# Altium schematic sheet sensor_module.SchDoc: Sensor Module
size A3; DocumentNumber: 1; Revision: F; SheetNumber: 1; SheetTotal: 1
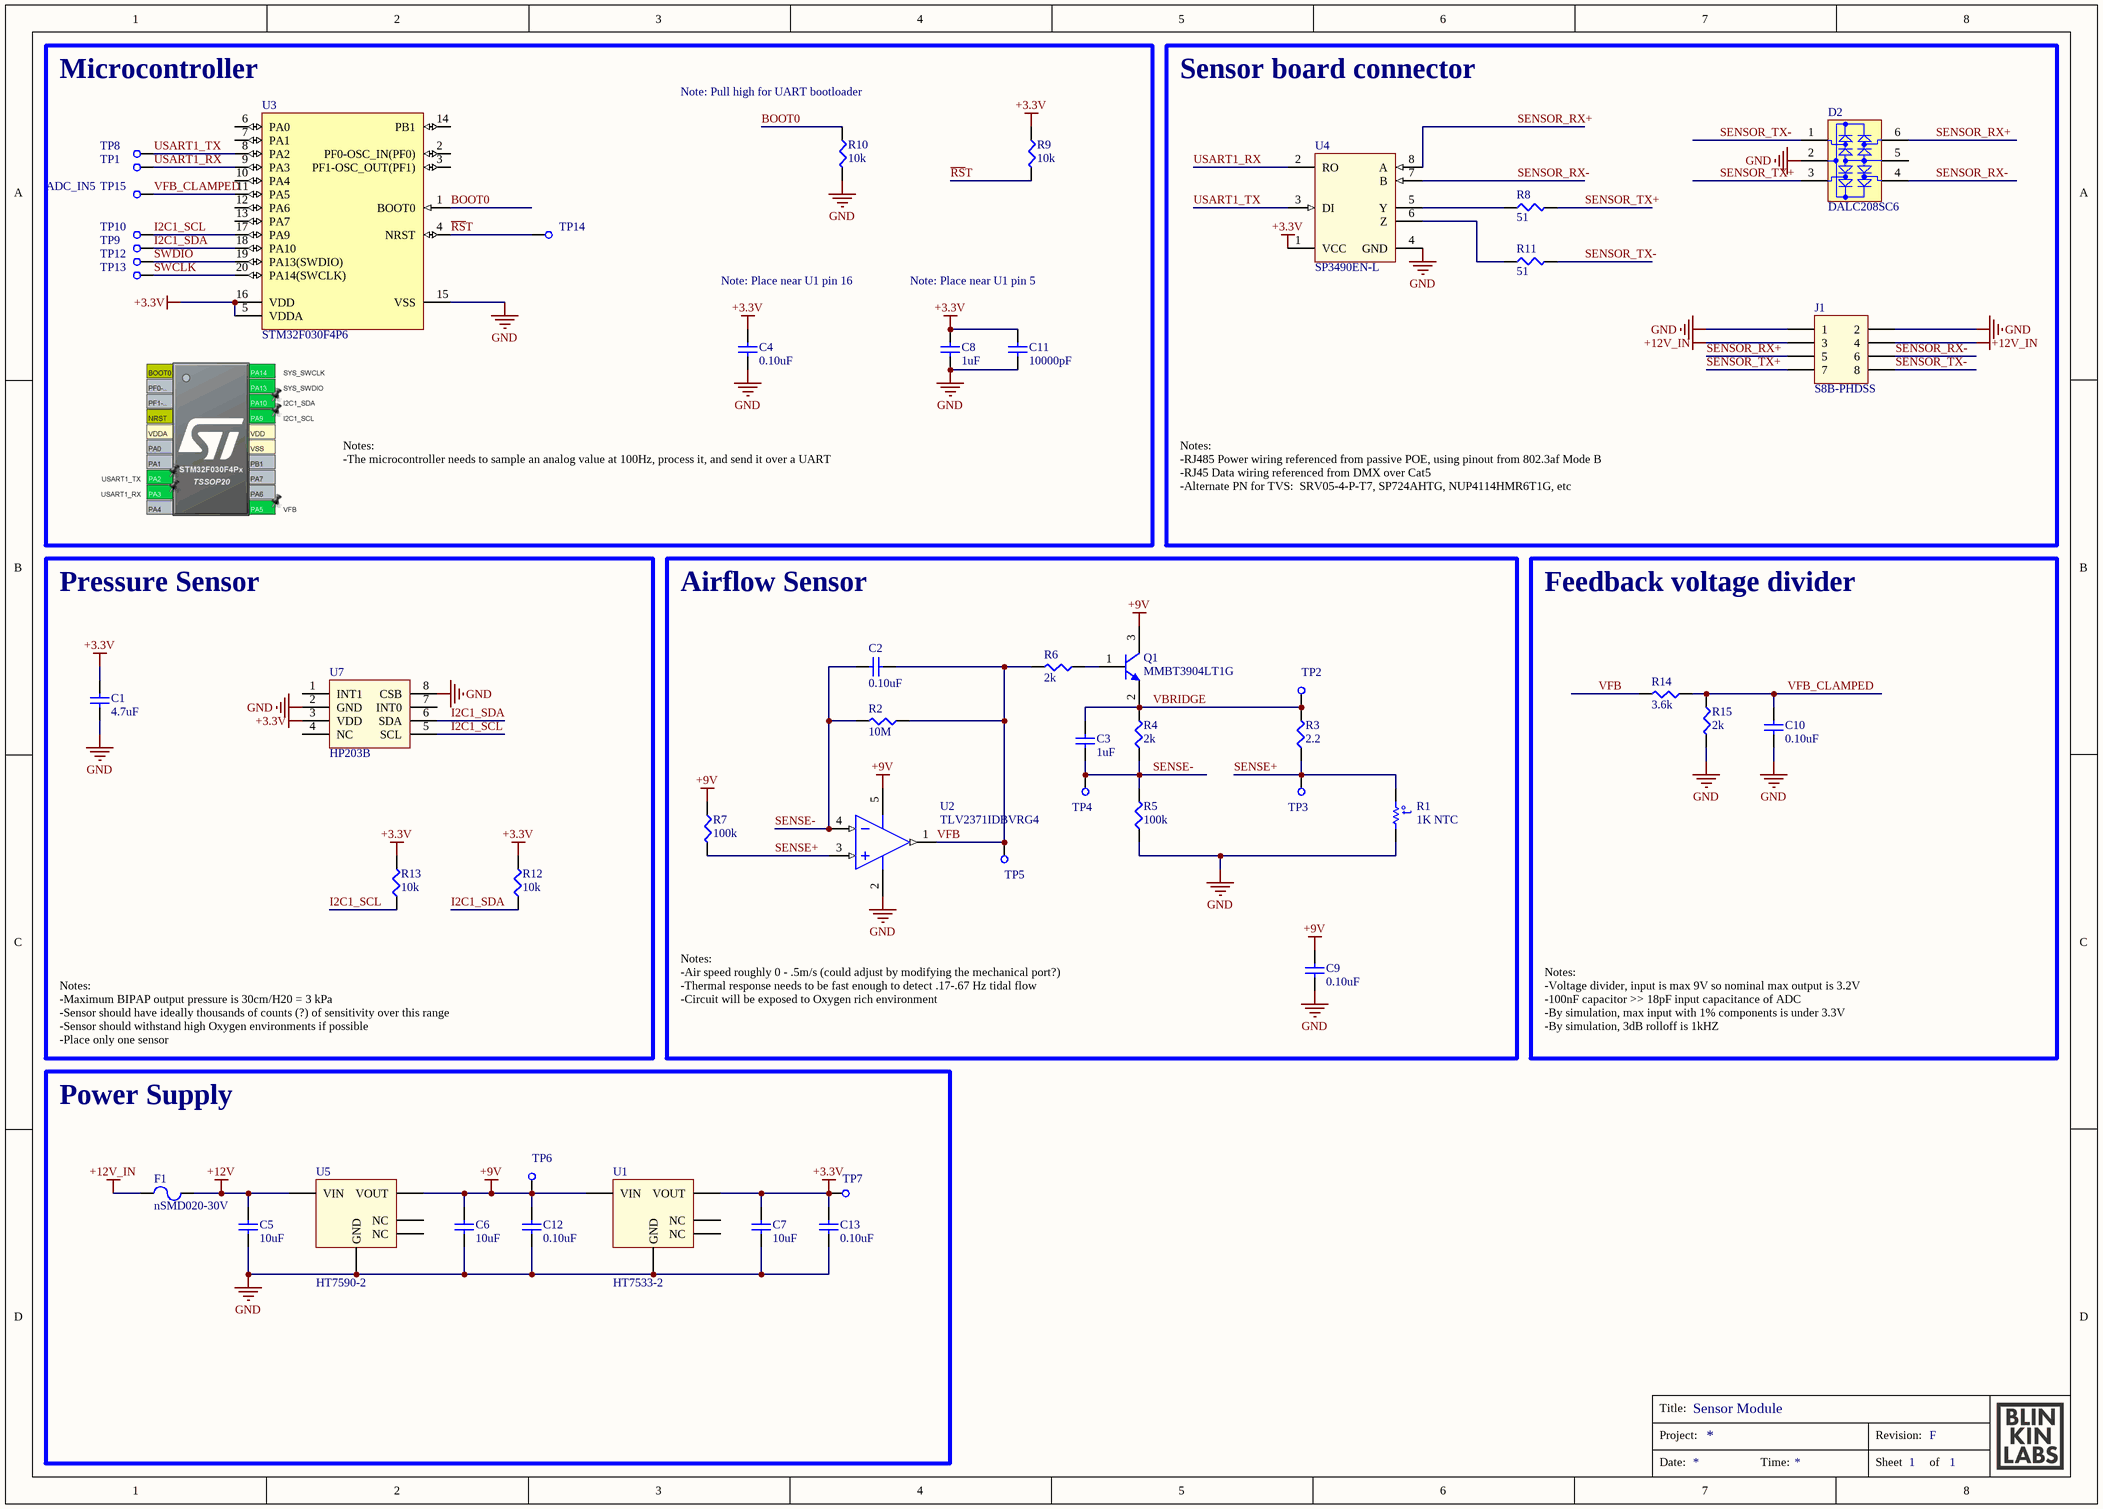
[diagram p0: sensor_module.SchDoc]

## Parts
C1  4.7uF  [CAPC1005X06N]
C2  0.10uF  [CAPC1005X06N]
C3  1uF  [CAPC1005X06N]
C4  0.10uF  [CAPC1005X06N]
C5  10uF  [CAPC2012X10L]
C6  10uF  [CAPC2012X10L]
C7  10uF  [CAPC2012X10L]
C8  1uF  [CAPC1005X06N]
C9  0.10uF  [CAPC1005X06N]
C10  0.10uF  [CAPC1005X06N]
C11  10000pF  [CAPC1005X06N]
C12  0.10uF  [CAPC1005X06N]
C13  0.10uF  [CAPC1005X06N]
D2  DALC208SC6  [STM-SOT23-6L_V]
F1  nSMD020-30V  [SEAANDLAND_1206]
J1  S8B-PHDSS  [S8B-PHDSS]
Q1  MMBT3904LT1G  [ONSC-SOT-23-3-318-08_V]
R1  1K NTC  [MURA-NCP18XH103F03RB-2_V]
R2  10M  [ERJ2G(0402)_N]
R3  2.2  [ERJ2G(0402)_N]
R4  2k  [ERJ2G(0402)_N]
R5  100k  [ERJ2G(0402)_N]
R6  2k  [ERJ2G(0402)_N]
R7  100k  [ERJ2G(0402)_N]
R8  51  [ERJ2G(0402)_N]
R9  10k  [ERJ2G(0402)_N]
R10  10k  [ERJ2G(0402)_N]
R11  51  [ERJ2G(0402)_N]
R12  10k  [ERJ2G(0402)_N]
R13  10k  [ERJ2G(0402)_N]
R14  3.6k  [ERJ2G(0402)_N]
R15  2k  [ERJ2G(0402)_N]
TP1  TEST_POINT  [TP-SMD-1mm]  (value not drawn)  (no BOM)
TP2  TEST_POINT  [TP-SMD-1mm]  (value not drawn)  (no BOM)
TP3  TEST_POINT  [TP-SMD-1mm]  (value not drawn)  (no BOM)
TP4  TEST_POINT  [TP-SMD-1mm]  (value not drawn)  (no BOM)
TP5  TEST_POINT  [TP-SMD-1mm]  (value not drawn)  (no BOM)
TP6  TEST_POINT  [TP-SMD-1mm]  (value not drawn)  (no BOM)
TP7  TEST_POINT  [TP-SMD-1mm]  (value not drawn)  (no BOM)
TP8  TEST_POINT  [TP-SMD-1mm]  (value not drawn)  (no BOM)
TP9  TEST_POINT  [TP-SMD-1mm]  (value not drawn)  (no BOM)
TP10  TEST_POINT  [TP-SMD-1mm]  (value not drawn)  (no BOM)
TP12  TEST_POINT  [TP-SMD-1mm]  (value not drawn)  (no BOM)
TP13  TEST_POINT  [TP-SMD-1mm]  (value not drawn)  (no BOM)
TP14  TEST_POINT  [TP-SMD-1mm]  (value not drawn)  (no BOM)
TP15  TEST_POINT  [TP-SMD-1mm]  (value not drawn)  (no BOM)
U1  HT7533-2  [SOT95P280X145-5N]
U2  TLV2371IDBVRG4  [TI-DBV5_N]
U3  STM32F030F4P6  [STM-TSSOP20_L]
U4  SP3490EN-L  [SOIC127P600X175-8N-2]
U5  HT7590-2  [SOT95P280X145-5N]
U7  HP203B  [HP203B]

## Blocks framed on the sheet
Microcontroller: C4 C8 C11 R9 R10 TP1 TP8-TP10 TP12-TP15 U3
Sensor board connector: D2 J1 R8 R11 U4
Pressure Sensor: C1 R12 R13 U7
Airflow Sensor: C2 C3 C9 Q1 R1-R7 TP2-TP5 U2
Feedback voltage divider: C10 R14 R15
Power Supply: C5-C7 C12 C13 F1 TP6 TP7 U1 U5

## Nets
+3.3V: C1.2 C4.2 C7.1 C8.2 C11.1 C13.2 R9.1 R12.2 R13.2 TP7.1(TP) U1.3(VOUT) U3.5(VDDA) U3.16(VDD) U4.1(VCC) U7.3(VDD)
+9V: C6.1 C9.2 C12.2 Q1.3(C) R7.1 TP6.1(TP) U1.2(VIN) U2.5(VDD) U5.3(VOUT)
+12V: C5.1 F1.2 U5.2(VIN)
+12V_IN: F1.1 J1.3 J1.4
GND: C1.1 C4.1 C5.2 C6.2 C7.2 C8.1 C9.1 C10.2 C11.2 C12.1 C13.1 D2.2(REF_2) J1.1 J1.2 R1.1 R5.1 R10.2 R15.2 U1.1(GND) U2.2(GND) U3.15(VSS) U4.4(GND) U5.1(GND) U7.2(GND) U7.8(CSB)
~{RS}T: R9.2 TP14.1(TP) U3.4(NRST)
BOOT0: R10.1 U3.1(BOOT0)
I2C1_SCL: R13.1 TP10.1(TP) U3.17(PA9) U7.5(SCL)
I2C1_SDA: R12.1 TP9.1(TP) U3.18(PA10) U7.6(SDA)
SENSE+: R1.2 R3.1 R7.2 TP3.1(TP) U2.3(IN+)
SENSE-: C2.2 C3.2 R2.2 R4.1 R5.2 TP4.1(TP) U2.4(IN-)
SENSOR_RX+: D2.6(I/O_4) J1.5 U4.8(A)
SENSOR_RX-: D2.4(I/O_3) J1.6 U4.7(B)
SENSOR_TX+: D2.3(I/O_2) J1.7 R8.2
SENSOR_TX-: D2.1(I/O_1) J1.8 R11.2
SWCLK: TP13.1(TP) U3.20(PA14(SWCLK))
SWDIO: TP12.1(TP) U3.19(PA13(SWDIO))
USART1_RX: TP1.1(TP) U3.9(PA3) U4.2(RO)
USART1_TX: TP8.1(TP) U3.8(PA2) U4.3(DI)
VBRIDGE: C3.1 Q1.2(E) R3.2 R4.2 TP2.1(TP)
VFB: C2.1 R2.1 R6.2 R14.2 TP5.1(TP) U2.1(OUT)
VFB_CLAMPED: C10.1 R14.1 R15.1 TP15.1(TP) U3.11(PA5)
NetQ1_1: Q1.1(B) R6.1
NetR8_1: R8.1 U4.5(Y)
NetR11_1: R11.1 U4.6(Z)

Not connected (* = marked no-connect by the designer): D2 5(REF_1); U1 4(NC) 5(NC); U3 2(PF0-OSC_IN(PF0)) 3(PF1-OSC_OUT(PF1)) 6(PA0) 7(PA1) 10(PA4) 12(PA6) 13(PA7) 14(PB1); U5 4(NC) 5(NC); U7 1(INT1) 4(NC) 7(INT0)

## Notes on the sheet
- (near R10) Note: Pull high for UART bootloader
- ADC_IN5
- Note: Place near U1 pin 16
- Note: Place near U1 pin 5
- Notes:
  -The microcontroller needs to sample an analog value at 100Hz, process it, and send it over a UART
- Notes:
  -RJ485 Power wiring referenced from passive POE, using pinout from 802.3af Mode B
  -RJ45 Data wiring referenced from DMX over Cat5
  -Alternate PN for TVS:  SRV05-4-P-T7, SP724AHTG, NUP4114HMR6T1G, etc
- Notes:
  -Maximum BIPAP output pressure is 30cm/H20 = 3 kPa
  -Sensor should have ideally thousands of counts (?) of sensitivity over this range
  -Sensor should withstand high Oxygen environments if possible
  -Place only one sensor
- Notes:
  -Air speed roughly 0 - .5m/s (could adjust by modifying the mechanical port?)
  -Thermal response needs to be fast enough to detect .17-.67 Hz tidal flow
  -Circuit will be exposed to Oxygen rich environment
- Notes:
  -Voltage divider, input is max 9V so nominal max output is 3.2V
  -100nF capacitor >> 18pF input capacitance of ADC
  -By simulation, max input with 1% components is under 3.3V
  -By simulation, 3dB rolloff is 1kHZ
- Title:
- Project:
- Revision:
- Date:
- Time:
- Sheet
- of
- (in symbol CMP-2000-05271-1) t°

## Library data of the parts
C1 = GRM155R60J475ME47D: CAP CER 4.7UF 6.3V X5R 0402; Manufacturer: Murata Electronics North America; Tolerance: ±20%; Datasheets: http://www.murata.com/~/media/webrenewal/support/library/catalog/products/capacitor/mlcc/c02e.pdf; Image: //media.digikey.com/Renders/Murata%20Renders/ZRB-SERIES-0402.jpg; Digi-Key Part Number: 490-5915-1-ND; Packaging: Cut Tape (CT); Series: GRM; Value: 4.7uF; Voltage: 6.3V; Temperature Coefficient: X5R; Operating Temperature: -55°C ~ 85°C; Features: Derating Recommended; Applications: General Purpose; Package / Case: 0402 (1005 Metric); Case/Package: 0402; PartNumber: GRM155R60J475ME47D
C2 C4 C9 C10 C12 C13 = GRM152R61A104ME19D: CAP CER 0.1UF 10V X5R 0402; Manufacturer: Murata Electronics North America; Tolerance: ±20%; Datasheets: http://www.murata.com/~/media/webrenewal/support/library/catalog/products/capacitor/mlcc/c02e.pdf; Image: //media.digikey.com/Renders/Murata%20Renders/ZRB-SERIES-0402.jpg; Digi-Key Part Number: 490-10009-1-ND; Packaging: Cut Tape (CT); Series: GRM; Value: 0.10uF; Voltage: 10V; Temperature Coefficient: X5R; Operating Temperature: -55°C ~ 85°C; Features: Derating Recommended; Applications: General Purpose; Package / Case: 0402 (1005 Metric); Case/Package: 0402; PartNumber: GRM152R61A104ME19D
C3 C8 = GRM155R61A105ME15D: CAP CER 1UF 10V X5R 0402; Manufacturer: Murata Electronics North America; Tolerance: ±20%; Datasheets: http://www.murata.com/~/media/webrenewal/support/library/catalog/products/capacitor/mlcc/c02e.pdf; Image: //media.digikey.com/Renders/Murata%20Renders/ZRB-SERIES-0402.jpg; Digi-Key Part Number: 490-5409-1-ND; Packaging: Cut Tape (CT); Series: GRM; Value: 1uF; Voltage: 10V; Temperature Coefficient: X5R; Operating Temperature: -55°C ~ 85°C; Features: -; Applications: General Purpose; Package / Case: 0402 (1005 Metric); Case/Package: 0402; PartNumber: GRM155R61A105ME15D
C5-C7 = GRM21BR61C106ME15L: CAP CER 10UF 16V X5R 0805; Manufacturer: Murata Electronics North America; Tolerance: ±20%; Datasheets: http://www.murata.com/~/media/webrenewal/support/library/catalog/products/capacitor/mlcc/c02e.pdf; Image: //media.digikey.com/Renders/Murata%20Renders/0805%20(2012%20Metric)%20.85mm.jpg; Digi-Key Part Number: 490-6474-1-ND; Series: GRM; Part Status: Active; Value: 10uF; Voltage: 16V; Temperature Coefficient: X5R; Operating Temperature: -55°C ~ 85°C; Features: -; Applications: General Purpose; Mounting Type: Surface Mount, MLCC; Package / Case: 0805 (2012 Metric); Case/Package: 0805; PartNumber: GRM21BR61C106ME15L
C11 = GRM155R61C103KA01D: CAP CER 10000PF 16V X5R 0402; Manufacturer: Murata Electronics North America; Tolerance: ±10%; Datasheets: http://www.murata.com/~/media/webrenewal/support/library/catalog/products/capacitor/mlcc/c02e.pdf; Image: //media.digikey.com/Renders/Murata%20Renders/ZRB-SERIES-0402.jpg; Digi-Key Part Number: 490-6309-1-ND; Packaging: Cut Tape (CT); Series: GRM; Value: 10000pF; Voltage: 16V; Temperature Coefficient: X5R; Operating Temperature: -55°C ~ 85°C; Features: -; Applications: General Purpose; Package / Case: 0402 (1005 Metric); Case/Package: 0402; PartNumber: GRM155R61C103KA01D
D2 = CMP-2000-06138-1: Low Capacitance Diode Array, 1 uA, 1.2 V, -55 to 150 degC, 6-Pin SOT23-6L, RoHS, Tape and Reel; Manufacturer: STMicroelectronics; Capacitance Value: 10pF; Working Voltage: 9V; Product Depth (mm): 1.75mm; Peak Non-Repetitive Surge Current (Max): 6; Rev Curr: 1; Peak Non-Repetitive Surge Current: 6A; Direction Type: Uni-Directional; Avg. Forward Curr (Max): 0.2; Suppressor Type: DiodeArrays; Product Length (mm): 3.05mm; Configuration: Octal; Product Height (mm): 1.3mm; Rad Hardened: No; Peak Rep Rev Volt: 9; Manufacturer URL: http://www.st.com/; Package / Case: SOT-23; Package Reference: SOT23-6L; Operating Temperature Min Deg. C: -55C; Mounting Style: SurfaceMount; Mounting Technology: SurfaceMount; Datasheet URL: http://www.st.com/st-web-ui/static/active/en/resource/technical/document/datasheet/CD00001734.pdf; Packaging: TapeandReel; Operating Temp Range: -55Cto150C; Operating Temperature Classification: Military; Operating Temperature Max Deg. C: 150C; Working Voltage (Max): 9V; Package Type: SOT-23; Datasheet Version: Rev. 7, 03/2008; Package Description: 6-Pin Small Outline Transistor, Body 2.925 x 1.625 mm, Pitch 0.95 mm; Mounting: SurfaceMount; Pin Count: 6
F1 = nSMD020-30V: Surface Mount Fuses 30V 100A 200mA 460mA 1206 RoHS; Manufacturer: Sea & Land Electronic Corp; PartNumber: NSMD020-30V; ComponentLink2Description: Datasheet; ComponentLink2URL: nSMD020-30V 0-2A-30V-Self-healing-fuse_C69680.pdf
J1 = S8B-PHDSS: CONN HEADER R/A 8POS 2MM; Manufacturer: JST; PartNumber: S8B-PHDSS
Q1 = CMP-1048-00631-1: General Purpose Transistor, NPN Silicon, 3-Pin SOT-23, Pb-Free, Tape and Reel; Manufacturer: On Semiconductor; IC Continuous (A): 0.2; fT Min (MHz): 300; ComponentLink2Description: Datasheet; Polarity: NPN; PackageDescription: 3-Pin Small Outline Transistor, Body 2.92 x 1.3 mm, Pitch 0.95 mm; ComponentLink2URL: http://www.onsemi.cn/pub_link/Collateral/MMBT3904LT1-D.PDF; DatasheetVersion: Rev. 12; Mounting Technology: Surface Mount; PartNumber: MMBT3904LT1G; ComponentLink1URL: http://www.onsemi.com/; ComponentLink3Description: Package Specification; ComponentLink1Description: Manufacturer URL; PackageVersion: Rev. AP, 11/2009; PackageReference: SOT-23-3-318-08; Packing: Tape and Reel; ComponentLink3URL: http://www.onsemi.cn/pub_link/Collateral/318-08.PDF; RoHS: TRUE
R1 = CMP-2000-05271-1: NTC Thermistor, 10 KOhm, +/- 1%, 0.1 W, -40 to 125 degC, 0603 (1608 Metric), RoHS, Tape and Reel; Manufacturer: Murata; B-constant: 3434K; Resistance: 10kO; Rated Current: 310A; Datasheet URL: http://www.jameco.com/Jameco/Products/ProdDS/1870999.pdf; Datasheet Version: Apr-05; Temperature Range: -40to+125degC; Tolerance (%): ±1%; Manufacturer URL: http://www.murata.com/; Type: NTC
R2 = ERJ-2GEJ106X: RES SMD 10M OHM 5% 1/10W 0402; Manufacturer: Panasonic Electronic Components; Factory Stock: 0; Unit Price (USD): 0.00350; @ qty: 1500; Minimum Quantity: 1; Power (Watts): 0.1W, 1/10W; Temperature Coefficient: -400/ +150ppm/°C; Part Number: ERJ-2GEJ106X; Datasheets: http://industrial.panasonic.com/www-cgi/jvcr13pz.cgi?E+PZ+3+AOA0001+ERJ2GEJ106X+7+WW; Image: //media.digikey.com/Photos/Panasonic%20Photos/ERJ-PA2-Series.jpg; Digi-Key Part Number: P10MJCT-ND; Quantity Available: 54777; Packaging: Cut Tape (CT); Series: ERJ; Part Status: Active; Value: 10M; Tolerance: ±5%; Composition: Thick Film; Features: Automotive AEC-Q200; Operating Temperature: -55°C ~ 155°C; Package / Case: 0402 (1005 Metric); Case/Package: 0402; Size / Dimension: 0.039" L x 0.020" W (1.00mm x 0.50mm); Height - Seated (Max): 0.016" (0.40mm); Number of Terminations: 2; Failure Rate: -; PartNumber: ERJ-2GEJ106X
R3 = ERJ-2GEJ2R2X: RES SMD 2.2 OHM 5% 1/10W 0402; Manufacturer: Panasonic Electronic Components; Power (Watts): 0.1W, 1/10W; Temperature Coefficient: -100/ +600ppm/°C; PartNumber: ERJ-2GEJ2R2X; Datasheets: http://industrial.panasonic.com/www-cgi/jvcr13pz.cgi?E+PZ+3+AOA0001+ERJ2GEJ2R2X+7+WW; Image: //media.digikey.com/Photos/Panasonic%20Photos/ERJ-PA2-Series.jpg; Digi-Key Part Number: P2.2JCT-ND; Series: ERJ; Value: 2.2; Tolerance: ±5%; Composition: Thick Film; Features: Automotive AEC-Q200; Operating Temperature: -55°C ~ 155°C; Package / Case: 0402 (1005 Metric); Case/Package: 0402; Size / Dimension: 0.039" L x 0.020" W (1.00mm x 0.50mm); Height - Seated (Max): 0.016" (0.40mm); Number of Terminations: 2
R4 R6 R15 = ERJ-2RKF2001X: RES SMD 2K OHM 1% 1/10W 0402; Manufacturer: Panasonic Electronic Components; Factory Stock: 0; Unit Price (USD): 0.00496; @ qty: 1500; Minimum Quantity: 1; Power (Watts): 0.1W, 1/10W; Temperature Coefficient: ±100ppm/°C; Part Number: ERJ-2RKF2001X; Datasheets: http://industrial.panasonic.com/www-cgi/jvcr13pz.cgi?E+PZ+3+AOA0002+ERJ2RKF2001X+7+WW; Image: //media.digikey.com/Photos/Panasonic%20Photos/ERJ-PA2-Series.jpg; Digi-Key Part Number: P2.00KLCT-ND; Quantity Available: 413346; Packaging: Cut Tape (CT); Series: ERJ; Part Status: Active; Value: 2k; Tolerance: ±1%; Composition: Thick Film; Features: Automotive AEC-Q200; Operating Temperature: -55°C ~ 155°C; Package / Case: 0402 (1005 Metric); Case/Package: 0402; Size / Dimension: 0.039" L x 0.020" W (1.00mm x 0.50mm); Height - Seated (Max): 0.016" (0.40mm); Number of Terminations: 2; Failure Rate: -; PartNumber: ERJ-2RKF2001X
R5 R7 = ERJ-2RKF1003X: RES SMD 100K OHM 1% 1/10W 0402; Manufacturer: Panasonic Electronic Components; Factory Stock: 0; Unit Price (USD): 0.00496; @ qty: 1500; Minimum Quantity: 1; Power (Watts): 0.1W, 1/10W; Temperature Coefficient: ±100ppm/°C; Part Number: ERJ-2RKF1003X; Datasheets: http://industrial.panasonic.com/www-cgi/jvcr13pz.cgi?E+PZ+3+AOA0002+ERJ2RKF1003X+7+WW; Image: //media.digikey.com/Photos/Panasonic%20Photos/ERJ-PA2-Series.jpg; Digi-Key Part Number: P100KLCT-ND; Quantity Available: 2645965; Packaging: Cut Tape (CT); Series: ERJ; Part Status: Active; Value: 100k; Tolerance: ±1%; Composition: Thick Film; Features: Automotive AEC-Q200; Operating Temperature: -55°C ~ 155°C; Package / Case: 0402 (1005 Metric); Case/Package: 0402; Size / Dimension: 0.039" L x 0.020" W (1.00mm x 0.50mm); Height - Seated (Max): 0.016" (0.40mm); Number of Terminations: 2; Failure Rate: -; PartNumber: ERJ-2RKF1003X
R8 R11 = ERJ-2GEJ510X: RES SMD 51 OHM 5% 1/10W 0402; Manufacturer: Panasonic Electronic Components; Factory Stock: 0; Unit Price (USD): 0.00350; @ qty: 1500; Minimum Quantity: 1; Power (Watts): 0.1W, 1/10W; Temperature Coefficient: ±200ppm/°C; Part Number: ERJ-2GEJ510X; Datasheets: http://industrial.panasonic.com/www-cgi/jvcr13pz.cgi?E+PZ+3+AOA0001+ERJ2GEJ510X+7+WW; Image: //media.digikey.com/Photos/Panasonic%20Photos/ERJ-PA2-Series.jpg; Digi-Key Part Number: P51JCT-ND; Quantity Available: 159188; Packaging: Cut Tape (CT); Series: ERJ; Part Status: Active; Value: 51; Tolerance: ±5%; Composition: Thick Film; Features: Automotive AEC-Q200; Operating Temperature: -55°C ~ 155°C; Package / Case: 0402 (1005 Metric); Case/Package: 0402; Size / Dimension: 0.039" L x 0.020" W (1.00mm x 0.50mm); Height - Seated (Max): 0.016" (0.40mm); Number of Terminations: 2; Failure Rate: -; PartNumber: ERJ-2GEJ510X
R9 R10 R12 R13 = ERJ-2GEJ103X: RES SMD 10K OHM 5% 1/10W 0402; Manufacturer: Panasonic Electronic Components; Factory Stock: 0; Unit Price (USD): 0.00350; @ qty: 1500; Minimum Quantity: 1; Power (Watts): 0.1W, 1/10W; Temperature Coefficient: ±200ppm/°C; Part Number: ERJ-2GEJ103X; Datasheets: http://industrial.panasonic.com/www-cgi/jvcr13pz.cgi?E+PZ+3+AOA0001+ERJ2GEJ103X+7+WW; Image: //media.digikey.com/Photos/Panasonic%20Photos/ERJ-PA2-Series.jpg; Digi-Key Part Number: P10KJCT-ND; Quantity Available: 2560215; Packaging: Cut Tape (CT); Series: ERJ; Part Status: Active; Value: 10k; Tolerance: ±5%; Composition: Thick Film; Features: Automotive AEC-Q200; Operating Temperature: -55°C ~ 155°C; Package / Case: 0402 (1005 Metric); Size / Dimension: 0.039" L x 0.020" W (1.00mm x 0.50mm); Height - Seated (Max): 0.016" (0.40mm); Number of Terminations: 2; Failure Rate: -; Case/Package: 0402; PartNumber: ERJ-2GEJ103X
R14 = ERJ-2RKF3601X: RES SMD 3.6K OHM 1% 1/10W 0402; Manufacturer: Panasonic Electronic Components; Factory Stock: 0; Unit Price (USD): 0.00496; @ qty: 1500; Minimum Quantity: 1; Power (Watts): 0.1W, 1/10W; Temperature Coefficient: ±100ppm/°C; Part Number: ERJ-2RKF3601X; Datasheets: http://industrial.panasonic.com/www-cgi/jvcr13pz.cgi?E+PZ+3+AOA0002+ERJ2RKF3601X+7+WW; Image: //media.digikey.com/Photos/Panasonic%20Photos/ERJ-PA2-Series.jpg; Digi-Key Part Number: P3.60KLCT-ND; Quantity Available: 24331; Packaging: Cut Tape (CT); Series: ERJ; Part Status: Active; Value: 3.6k; Tolerance: ±1%; Composition: Thick Film; Features: Automotive AEC-Q200; Operating Temperature: -55°C ~ 155°C; Package / Case: 0402 (1005 Metric); Case/Package: 0402; Size / Dimension: 0.039" L x 0.020" W (1.00mm x 0.50mm); Height - Seated (Max): 0.016" (0.40mm); Number of Terminations: 2; Failure Rate: -; PartNumber: ERJ-2RKF3601X
TP1-TP10 TP12-TP15 = TEST_POINT: Test point
U1 = HT7533-2: 3.3V 100mA TinyPower LDO; Manufacturer: Holtek; PartNumber: HT7533-2
U2 = CMP-0272-03306-2: 550 uA/Ch, 3 MHz, RRIO Operational Amplifier, 2.7 to 16 V, -40 to 125 degC, 5-pin SOT23 (DBV5), Green (RoHS & no Sb/Br); Manufacturer: Texas Instruments; CMRR(Min)(dB): 50; Total Supply Voltage(Max)(+5V is 5, +/-5V is 10): 16; Offset Drift(Typ)(uV/C): 2; Iq per channel(Max)(mA): 0.9; Rating: Catalog; Slew Rate(Typ)(V/us): 2.4; GBW(Typ)(MHz): 3; Total Supply Voltage(Min)(+5V is 5, +/-5V is 10): 2.7; Vio (25C)(Max)(mV): 4.5; Number of Channels: 1; Packing: LARGE T&R; IIB(Max)(pA): 60; Sub Family: Low Supply Voltage Amplifier (<=2.7V), Precision Amplifier; Code_JEDEC: MO-178; PackageReference: DBV5; ComponentLink3URL: http://www.ti.com/litv/pdf/mpds018i; ComponentLink1URL: http://www.ti.com/; PackageVersion: 4073253-4/K, 03/2006; ComponentLink3Description: Package Specification; Eco-Plan: Green (RoHS & no Sb/Br); PartNumber: TLV2371IDBVRG4; PackageDescription: 5-Pin Plastic Small Outline, Body 1.6 x 2.9 mm, Pitch 0.95 mm; ComponentLink2Description: Datasheet; DatasheetVersion: SLOS270D; Mounting Technology: Surface Mount; ComponentLink2URL: http://www.ti.com/lit/ds/symlink/tlv2371.pdf; ComponentLink1Description: Manufacturer URL
U3 = CMP-0304-00039-2: ARM Cortex-M0 32-bit MCU, 16 KB Flash, 4 KB Internal RAM, 15 I/Os, 20-pin TSSOP, -40 to 85 degC, Tube; I/Os (High Current): 15; FLASH Size (Prog) (kB): 16; Internal RAM Size (kB): 4; Supply Voltage(Vcc) min (V): 2.4; Operating Frequency(F) (Processor speed) (MHz): 48; ComponentLink2URL: http://www.st.com/st-web-ui/static/active/en/resource/technical/document/datasheet/DM00088500.pdf; Core: ARM Cortex-M0; ComponentLink2Description: Datasheet; PackageDescription: 20-Pin Thin Shrink Small Outline Package, 6.5 x 4.4 mm Body, 0.65 mm Pitch; Mounting Technology: Surface Mount; ComponentLink1URL: http://www.st.com/web/en/home.html; PackageVersion: Rev. 1, 11/2012; ComponentLink3Description: Package Specification; PartNumber: STM32F030F4P6; ComponentLink3URL: http://www.st.com/st-web-ui/static/active/en/resource/technical/document/datasheet/DM00065136.pdf; DatasheetVersion: Rev. 1; PackageReference: TSSOP20; ComponentLink1Description: Manufacturer URL; Packing: Tube
U4 = SP3490EN-L: +3.3V Low Power Full-Duplex RS-485 Transceivers with 10Mbps Data Rate; Manufacturer: Exar; PartNumber: SP3490EN-L
U5 = HT7590-2: 9V 100mA TinyPower LDO; Manufacturer: Holtek; PartNumber: HT7590-2
U7 = HP203B: PRECISION BAROMETER AND ALTIMETER SENSOR; Manufacturer: HopeRF; PartNumber: HP203B